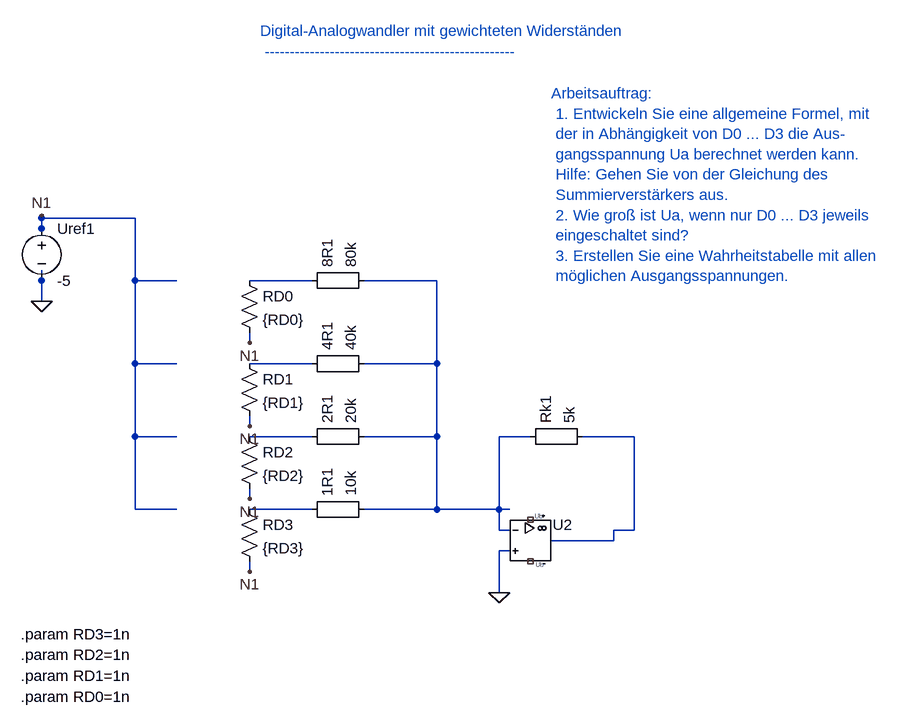
[diagram p0: schematic 8_1_2_DAC_mit_Summierverstärker.asc]
8_1_2_DAC_mit_Summierverstärker.asc, the LTspice schematic file:
Version 4
SHEET 1 880 680
WIRE 96 432 96 416
WIRE 816 816 800 816
WIRE 800 816 800 784
WIRE 800 784 816 784
WIRE 880 832 976 832
WIRE 976 832 976 816
WIRE 96 464 96 416
WIRE 800 912 800 848
WIRE 800 848 816 848
WIRE 928 672 1008 672
WIRE 1008 672 1008 816
WIRE 1008 816 976 816
WIRE 96 352 96 336
WIRE 96 336 240 336
WIRE 240 336 240 432
WIRE 240 432 304 432
WIRE 304 560 240 560
WIRE 240 560 240 432
WIRE 304 672 240 672
WIRE 240 672 240 560
WIRE 304 784 240 784
WIRE 240 784 240 672
WIRE 416 432 512 432
WIRE 800 784 800 672
WIRE 800 672 848 672
WIRE 592 432 704 432
WIRE 704 432 704 560
WIRE 704 784 800 784
WIRE 592 784 704 784
WIRE 704 560 704 672
WIRE 592 560 704 560
WIRE 416 560 512 560
WIRE 416 672 512 672
WIRE 416 784 512 784
WIRE 704 672 704 784
WIRE 592 672 704 672
WIRE 416 752 416 768
WIRE 416 640 416 656
WIRE 416 512 416 528
WIRE 96 352 96 332
WIRE 416 864 416 880
FLAG 96 464 0
FLAG 800 912 0
FLAG 96 464 0
FLAG 800 912 0
FLAG 416 768 N1
FLAG 416 656 N1
FLAG 416 528 N1
FLAG 96 332 N1
FLAG 416 880 N1
SYMBOL voltage 96 336 R0
SYMATTR InstName Uref1
SYMATTR Value -5
SYMBOL Misc\EuropeanResistor 496 800 R270
SYMATTR InstName 1R1
SYMATTR Value 10k
SYMBOL Misc\EuropeanResistor 496 688 R270
SYMATTR InstName 2R1
SYMATTR Value 20k
SYMBOL Misc\EuropeanResistor 496 576 R270
SYMATTR InstName 4R1
SYMATTR Value 40k
SYMBOL Misc\EuropeanResistor 496 448 R270
SYMATTR InstName 8R1
SYMATTR Value 80k
SYMBOL UniversalOpAmp2 848 832 R0
SYMATTR InstName U2
SYMATTR Value UniversalOpAmp2
SYMBOL Misc\EuropeanResistor 832 688 R270
SYMATTR InstName Rk1
SYMATTR Value 5k
SYMBOL res 400 768 R0
SYMATTR InstName RD3
SYMATTR Value {RD3}
SYMBOL res 400 656 R0
SYMATTR InstName RD2
SYMATTR Value {RD2}
SYMBOL res 400 544 R0
SYMATTR InstName RD1
SYMATTR Value {RD1}
SYMBOL res 400 416 R0
SYMATTR InstName RD0
SYMATTR Value {RD0}
TEXT 64 976 Left 2 !.param RD3=1n
TEXT 64 1008 Left 2 !.param RD2=1n
TEXT 64 1040 Left 2 !.param RD1=1n
TEXT 64 1072 Left 2 !.param RD0=1n
TEXT 432 48 Left 2 ;Digital-Analogwandler mit gewichteten Widerständen \n --------------------------------------------------
TEXT 880 144 Left 2 ;Arbeitsauftrag: \n 1. Entwickeln Sie eine allgemeine Formel, mit \n der in Abhängigkeit von D0 ... D3 die Aus- \n gangsspannung Ua berechnet werden kann. \n Hilfe: Gehen Sie von der Gleichung des \n Summierverstärkers aus. \n 2. Wie groß ist Ua, wenn nur D0 ... D3 jeweils \n eingeschaltet sind? \n 3. Erstellen Sie eine Wahrheitstabelle mit allen \n möglichen Ausgangsspannungen.

The netlist it stands for:
* 8_1_2_DAC_mit_Summierverstärker.asc
V§Uref1 N1 0 -5
R§1R1 N006 N001 10k
R§2R1 N005 N001 20k
R§4R1 N004 N001 40k
R§8R1 N003 N001 80k
XU2 0 N001 NC_01 NC_02 N002 level2 UniversalOpAmp2 Avol=1Meg GBW=10Meg Slew=10Meg Ilimit=25m Rail=0 Vos=0 En=0 Enk=0 In=0 Ink=0 Rin=500Meg  ; pins In+ In- V+ V- OUT
Rk1 N001 N002 5k
RD3 N006 N1 {RD3}
RD2 N005 N1 {RD2}
RD1 N004 N1 {RD1}
RD0 N003 N1 {RD0}
.param RD3=1n
.param RD2=1n
.param RD1=1n
.param RD0=1n
* Digital-Analogwandler mit gewichteten Widerständen
*  --------------------------------------------------
* Arbeitsauftrag:
*  1. Entwickeln Sie eine allgemeine Formel, mit
*  der in Abhängigkeit von D0 ... D3 die Aus-
*  gangsspannung Ua berechnet werden kann.
*  Hilfe: Gehen Sie von der Gleichung des
*  Summierverstärkers aus.
*  2. Wie groß ist Ua, wenn nur D0 ... D3 jeweils
*  eingeschaltet sind?
*  3. Erstellen Sie eine Wahrheitstabelle mit allen
*  möglichen Ausgangsspannungen.
.lib UniversalOpAmp2.lib
.backanno
.end